# Altium project stm32-plc.PrjPcb (part 1 of 2)
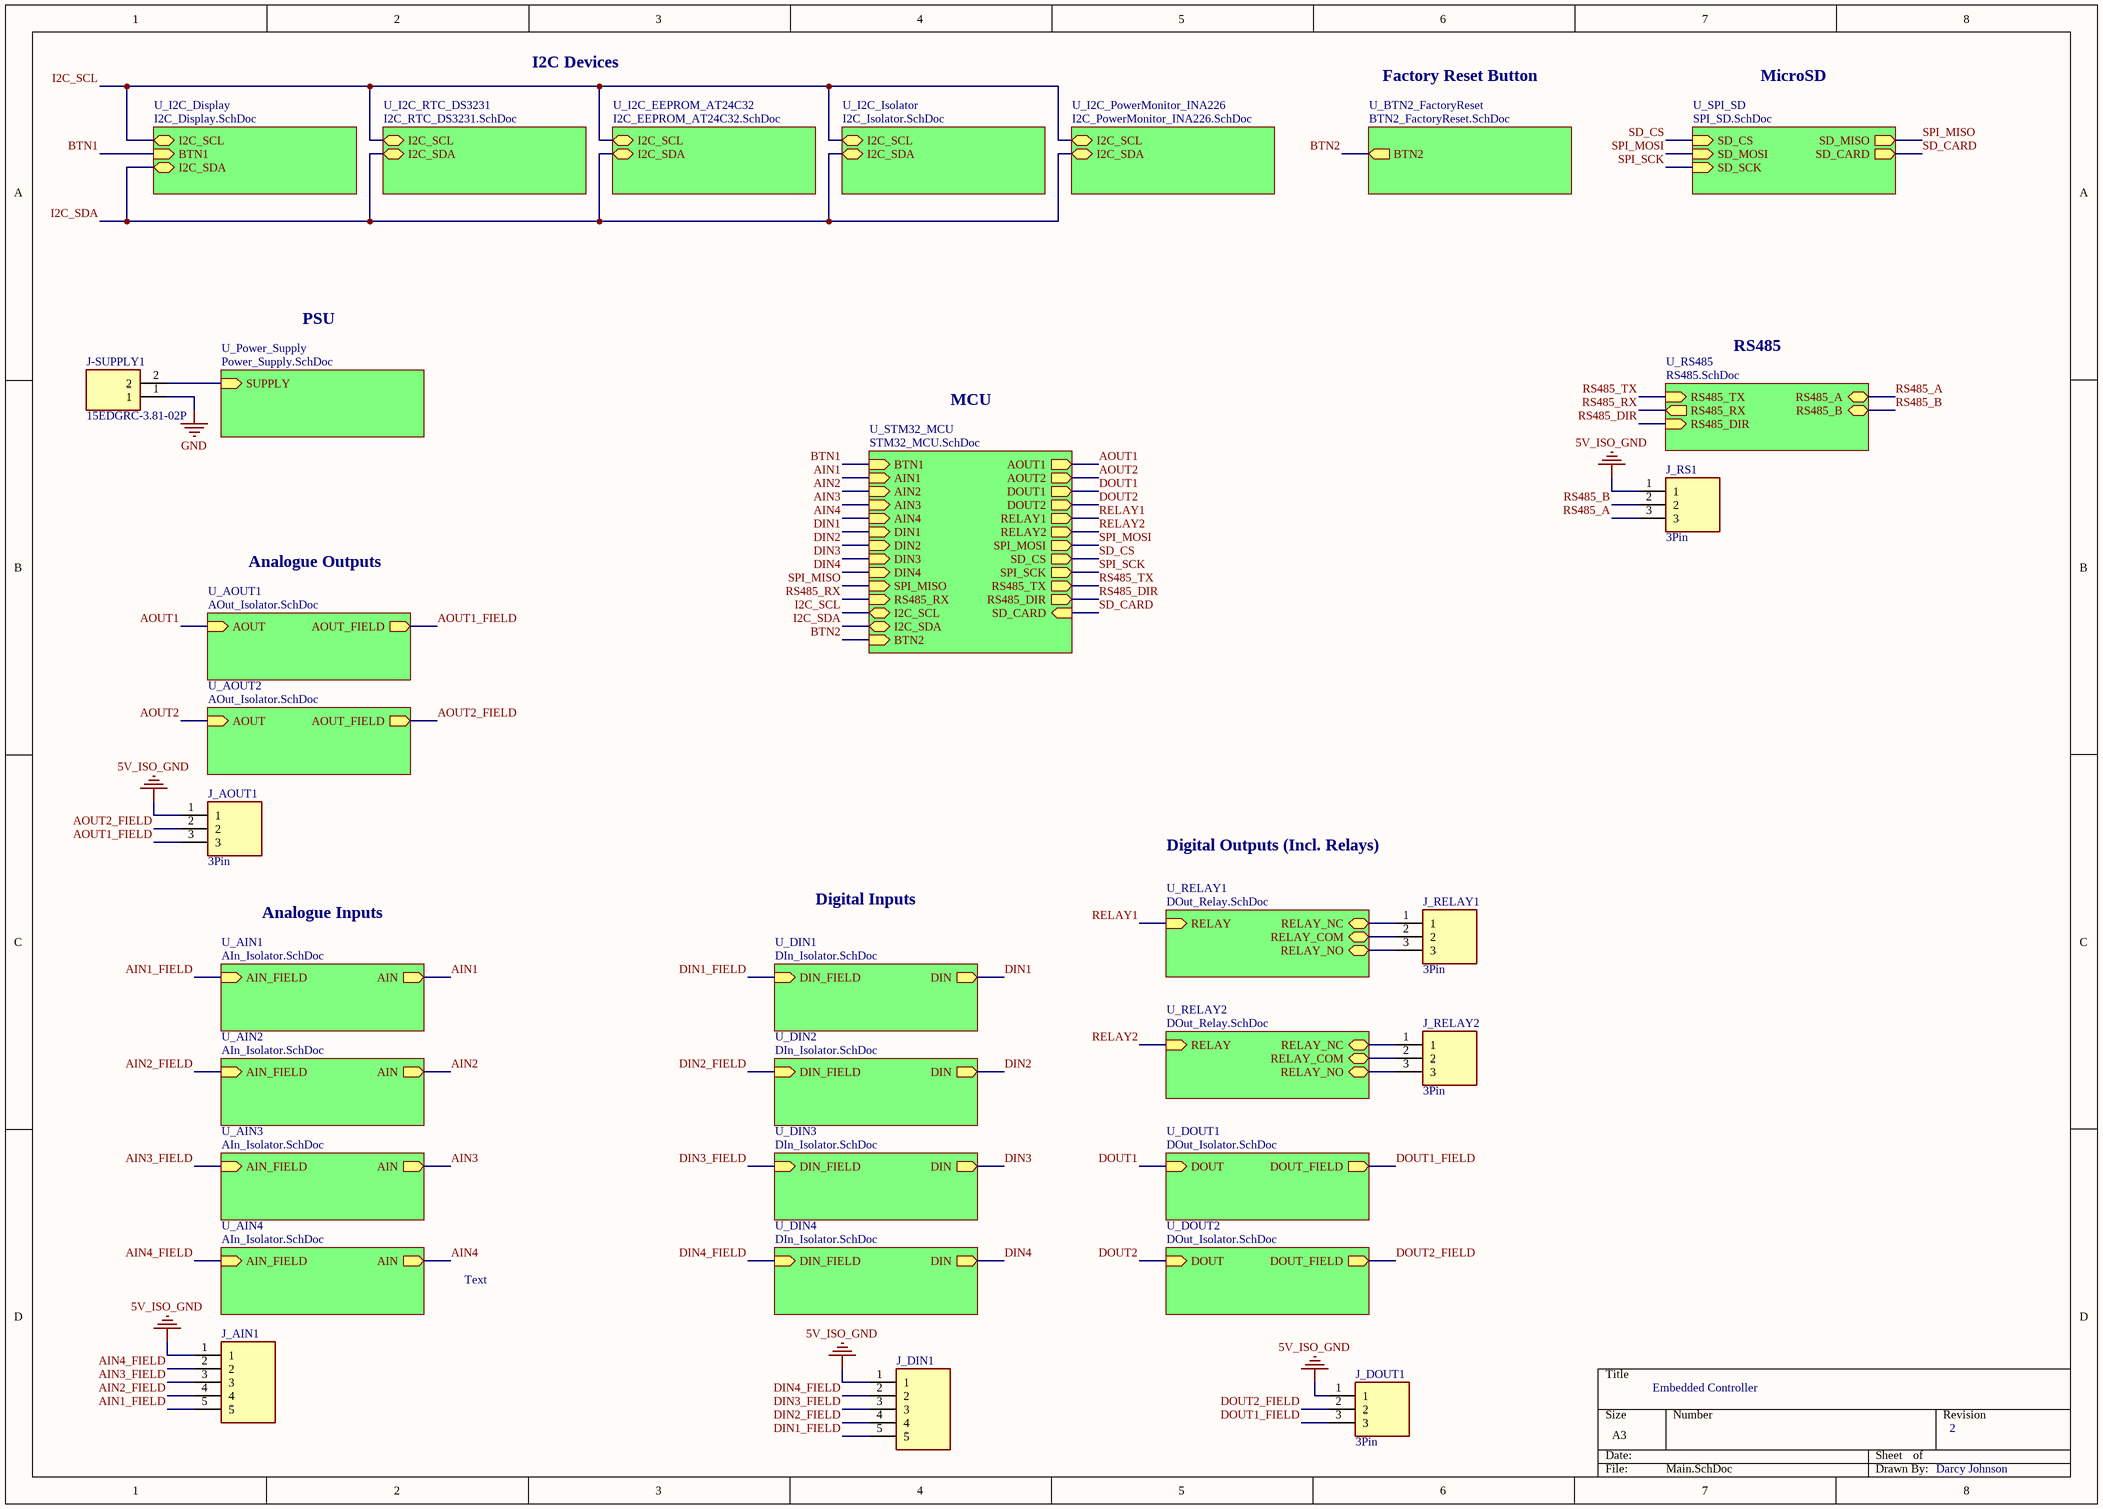
[diagram p0: Main.SchDoc]
Title: Embedded Controller; Revision: 2; DrawnBy: Darcy Johnson
16 sheets, 236 parts. Net scope: hierarchical (ports join the sheet entries above them; power ports are global).
Board file: Main.PcbDoc
Sheets:
  Main.SchDoc
    U_Power_Supply = Power_Supply.SchDoc
    U_I2C_Display = I2C_Display.SchDoc
    U_I2C_EEPROM_AT24C32 = I2C_EEPROM_AT24C32.SchDoc
    U_I2C_RTC_DS3231 = I2C_RTC_DS3231.SchDoc
    U_RS485 = RS485.SchDoc
    U_I2C_Isolator = I2C_Isolator.SchDoc
    U_AIN1 = AIn_Isolator.SchDoc
    U_AIN2 = AIn_Isolator.SchDoc
    U_AIN3 = AIn_Isolator.SchDoc
    U_AIN4 = AIn_Isolator.SchDoc
    U_AOUT1 = AOut_Isolator.SchDoc
    U_AOUT2 = AOut_Isolator.SchDoc
    U_BTN2_FactoryReset = BTN2_FactoryReset.SchDoc
    U_STM32_MCU = STM32_MCU.SchDoc
    U_I2C_PowerMonitor_INA226 = I2C_PowerMonitor_INA226.SchDoc
    U_RELAY1 = DOut_Relay.SchDoc
    U_RELAY2 = DOut_Relay.SchDoc
    U_DIN1 = DIn_Isolator.SchDoc
    U_DIN2 = DIn_Isolator.SchDoc
    U_DIN3 = DIn_Isolator.SchDoc
    U_DIN4 = DIn_Isolator.SchDoc
    U_SPI_SD = SPI_SD.SchDoc
    U_DOUT1 = DOut_Isolator.SchDoc
    U_DOUT2 = DOut_Isolator.SchDoc

## Sheet Main.SchDoc: Embedded Controller
size A3; DocumentNumber: 1; SheetNumber: 1; SheetTotal: 16

### Parts
J-SUPPLY1  15EDGRC-3.81-02P  [15EDGRC-3.81-02P]
J_AIN1  (no value)  [15EDGRC-3.81-05P]
J_AOUT1  3Pin  [15EDGRC-3.81-03P]
J_DIN1  (no value)  [15EDGRC-3.81-05P]
J_DOUT1  3Pin  [15EDGRC-3.81-03P]
J_RELAY1  3Pin  [15EDGRC-3.81-03P]
J_RELAY2  3Pin  [15EDGRC-3.81-03P]
J_RS1  3Pin  [15EDGRC-3.81-03P]

### Sub-sheets
U_AIN1 = AIn_Isolator.SchDoc: AIN (out), AIN_FIELD (in)
U_AIN2 = AIn_Isolator.SchDoc: AIN (out), AIN_FIELD (in)
U_AIN3 = AIn_Isolator.SchDoc: AIN (out), AIN_FIELD (in)
U_AIN4 = AIn_Isolator.SchDoc: AIN (out), AIN_FIELD (in)
U_AOUT1 = AOut_Isolator.SchDoc: AOUT_FIELD (out), AOUT (in)
U_AOUT2 = AOut_Isolator.SchDoc: AOUT_FIELD (out), AOUT (in)
U_BTN2_FactoryReset = BTN2_FactoryReset.SchDoc: BTN2 (out)
U_DIN1 = DIn_Isolator.SchDoc: DIN_FIELD (in), DIN (out)
U_DIN2 = DIn_Isolator.SchDoc: DIN_FIELD (in), DIN (out)
U_DIN3 = DIn_Isolator.SchDoc: DIN_FIELD (in), DIN (out)
U_DIN4 = DIn_Isolator.SchDoc: DIN_FIELD (in), DIN (out)
U_DOUT1 = DOut_Isolator.SchDoc: DOUT (in), DOUT_FIELD (out)
U_DOUT2 = DOut_Isolator.SchDoc: DOUT (in), DOUT_FIELD (out)
U_I2C_Display = I2C_Display.SchDoc: I2C_SCL (bidir), I2C_SDA (bidir), BTN1 (in)
U_I2C_EEPROM_AT24C32 = I2C_EEPROM_AT24C32.SchDoc: I2C_SCL (bidir), I2C_SDA (bidir)
U_I2C_Isolator = I2C_Isolator.SchDoc: I2C_SCL (bidir), I2C_SDA (bidir)
U_I2C_PowerMonitor_INA226 = I2C_PowerMonitor_INA226.SchDoc: I2C_SCL (bidir), I2C_SDA (bidir)
U_I2C_RTC_DS3231 = I2C_RTC_DS3231.SchDoc: I2C_SDA (bidir), I2C_SCL (bidir)
U_Power_Supply = Power_Supply.SchDoc: SUPPLY (in)
U_RELAY1 = DOut_Relay.SchDoc: RELAY (in), RELAY_NO (bidir), RELAY_NC (bidir), RELAY_COM (bidir)
U_RELAY2 = DOut_Relay.SchDoc: RELAY (in), RELAY_NO (bidir), RELAY_NC (bidir), RELAY_COM (bidir)
U_RS485 = RS485.SchDoc: RS485_RX (out), RS485_TX (in), RS485_DIR (in), RS485_A (bidir), RS485_B (bidir)
U_SPI_SD = SPI_SD.SchDoc: SD_CS (in), SD_MOSI (in), SD_SCK (in), SD_MISO (out), SD_CARD (out)
U_STM32_MCU = STM32_MCU.SchDoc: BTN1 (in), AIN1 (in), AIN2 (in), AIN3 (in), AIN4 (in), DIN1 (in), DIN2 (in), DIN3 (in), DIN4 (in), AOUT1 (out), AOUT2 (out), DOUT1 (out), DOUT2 (out), RELAY1 (out), RELAY2 (out), SPI_MISO (in), SPI_MOSI (out), SD_CS (out), SPI_SCK (out), RS485_TX (out), RS485_RX (in), RS485_DIR (out), I2C_SCL (bidir), I2C_SDA (bidir), BTN2 (in), SD_CARD (in)

### Nets
5V_ISO_GND: J_AIN1.1 J_AOUT1.1 J_DIN1.1 J_DOUT1.1 J_RS1.1
GND: J-SUPPLY1.1
AIN1: sheet U_AIN1/AIN, sheet U_STM32_MCU/AIN1
AIN1_FIELD: J_AIN1.5 ; sheet U_AIN1/AIN_FIELD
AIN2: sheet U_AIN2/AIN, sheet U_STM32_MCU/AIN2
AIN2_FIELD: J_AIN1.4 ; sheet U_AIN2/AIN_FIELD
AIN3: sheet U_AIN3/AIN, sheet U_STM32_MCU/AIN3
AIN3_FIELD: J_AIN1.3 ; sheet U_AIN3/AIN_FIELD
AIN4: sheet U_AIN4/AIN, sheet U_STM32_MCU/AIN4
AIN4_FIELD: J_AIN1.2 ; sheet U_AIN4/AIN_FIELD
AOUT1: sheet U_AOUT1/AOUT, sheet U_STM32_MCU/AOUT1
AOUT1_FIELD: J_AOUT1.3 ; sheet U_AOUT1/AOUT_FIELD
AOUT2: sheet U_AOUT2/AOUT, sheet U_STM32_MCU/AOUT2
AOUT2_FIELD: J_AOUT1.2 ; sheet U_AOUT2/AOUT_FIELD
BTN1: sheet U_I2C_Display/BTN1, sheet U_STM32_MCU/BTN1
BTN2: sheet U_BTN2_FactoryReset/BTN2, sheet U_STM32_MCU/BTN2
DIN1: sheet U_STM32_MCU/DIN1, sheet U_DIN1/DIN
DIN1_FIELD: J_DIN1.5 ; sheet U_DIN1/DIN_FIELD
DIN2: sheet U_STM32_MCU/DIN2, sheet U_DIN2/DIN
DIN2_FIELD: J_DIN1.4 ; sheet U_DIN2/DIN_FIELD
DIN3: sheet U_STM32_MCU/DIN3, sheet U_DIN3/DIN
DIN3_FIELD: J_DIN1.3 ; sheet U_DIN3/DIN_FIELD
DIN4: sheet U_STM32_MCU/DIN4, sheet U_DIN4/DIN
DIN4_FIELD: J_DIN1.2 ; sheet U_DIN4/DIN_FIELD
DOUT1: sheet U_STM32_MCU/DOUT1, sheet U_DOUT1/DOUT
DOUT1_FIELD: J_DOUT1.3 ; sheet U_DOUT1/DOUT_FIELD
DOUT2: sheet U_STM32_MCU/DOUT2, sheet U_DOUT2/DOUT
DOUT2_FIELD: J_DOUT1.2 ; sheet U_DOUT2/DOUT_FIELD
I2C_SCL: sheet U_I2C_Display/I2C_SCL, sheet U_I2C_EEPROM_AT24C32/I2C_SCL, sheet U_I2C_RTC_DS3231/I2C_SCL, sheet U_I2C_Isolator/I2C_SCL, sheet U_STM32_MCU/I2C_SCL, sheet U_I2C_PowerMonitor_INA226/I2C_SCL
I2C_SDA: sheet U_I2C_Display/I2C_SDA, sheet U_I2C_EEPROM_AT24C32/I2C_SDA, sheet U_I2C_RTC_DS3231/I2C_SDA, sheet U_I2C_Isolator/I2C_SDA, sheet U_STM32_MCU/I2C_SDA, sheet U_I2C_PowerMonitor_INA226/I2C_SDA
RELAY1: sheet U_STM32_MCU/RELAY1, sheet U_RELAY1/RELAY  [project net PB1]
RELAY2: sheet U_STM32_MCU/RELAY2, sheet U_RELAY2/RELAY  [project net PB2]
RS485_A: J_RS1.3 ; sheet U_RS485/RS485_A  [project net A]
RS485_B: J_RS1.2 ; sheet U_RS485/RS485_B  [project net B]
RS485_DIR: sheet U_RS485/RS485_DIR, sheet U_STM32_MCU/RS485_DIR  [project net PA8]
RS485_RX: sheet U_RS485/RS485_RX, sheet U_STM32_MCU/RS485_RX  [project net PA10]
RS485_TX: sheet U_RS485/RS485_TX, sheet U_STM32_MCU/RS485_TX  [project net PA9]
SD_CARD: sheet U_STM32_MCU/SD_CARD, sheet U_SPI_SD/SD_CARD  [project net CARD_DETECT]
SD_CS: sheet U_STM32_MCU/SD_CS, sheet U_SPI_SD/SD_CS  [project net DAT3]
SPI_MISO: sheet U_STM32_MCU/SPI_MISO, sheet U_SPI_SD/SD_MISO  [project net DAT0]
SPI_MOSI: sheet U_STM32_MCU/SPI_MOSI, sheet U_SPI_SD/SD_MOSI  [project net CMD]
SPI_SCK: sheet U_STM32_MCU/SPI_SCK, sheet U_SPI_SD/SD_SCK  [project net PB3]
NetF1_1: J-SUPPLY1.2 ; sheet U_Power_Supply/SUPPLY
NetJ_RELAY1_1: J_RELAY1.1 ; sheet U_RELAY1/RELAY_NC
NetJ_RELAY1_2: J_RELAY1.2 ; sheet U_RELAY1/RELAY_COM
NetJ_RELAY1_3: J_RELAY1.3 ; sheet U_RELAY1/RELAY_NO
NetJ_RELAY2_1: J_RELAY2.1 ; sheet U_RELAY2/RELAY_NC
NetJ_RELAY2_2: J_RELAY2.2 ; sheet U_RELAY2/RELAY_COM
NetJ_RELAY2_3: J_RELAY2.3 ; sheet U_RELAY2/RELAY_NO

### Notes on the sheet
- I2C Devices
- Factory Reset Button
- MicroSD
- PSU
- RS485
- MCU
- Analogue Outputs
- Digital Outputs (Incl. Relays)
- Analogue Inputs
- Digital Inputs
- Text

### Library data of the parts
J-SUPPLY1 = 15EDGRC-3.81-02P: Manufacturer_Name: Degson; Manufacturer_Part_Number: 15EDGRC-3.81-02P-14-00A(H); Geometry.Height: 7.2mm; Mouser Part Number: *; Mouser Price/Stock: *; Arrow Part Number: *; Arrow Price/Stock: *; Datasheet Link: https://www.tme.com/uz/ru/details/15edgrc3.81-02p/klemmnye-kolodki-razemnogo-tipa/degson-electronics/15edgrc-3-81-02p-14-00a-h/
J_AIN1 J_DIN1 = 15EDGRC-3.81-05P: Manufacturer_Name: Degson; Manufacturer_Part_Number: 15EDGRC-3.81-02P-14-00A(H); Geometry.Height: 7.2mm; Mouser Part Number: *; Mouser Price/Stock: *; Arrow Part Number: *; Arrow Price/Stock: *; Datasheet Link: https://www.tme.com/uz/ru/details/15edgrc3.81-02p/klemmnye-kolodki-razemnogo-tipa/degson-electronics/15edgrc-3-81-02p-14-00a-h/
J_AOUT1 J_DOUT1 J_RELAY1 J_RELAY2 J_RS1 = 15EDGRC-3.81-03P: Manufacturer_Name: Degson; Manufacturer_Part_Number: 15EDGRC-3.81-02P-14-00A(H); Geometry.Height: 7.2mm; Mouser Part Number: *; Mouser Price/Stock: *; Arrow Part Number: *; Arrow Price/Stock: *; Datasheet Link: https://www.tme.com/uz/ru/details/15edgrc3.81-02p/klemmnye-kolodki-razemnogo-tipa/degson-electronics/15edgrc-3-81-02p-14-00a-h/

## Sheet Power_Supply.SchDoc: Embedded Controller
size A4; DocumentNumber: 8; SheetNumber: 8; SheetTotal: 16
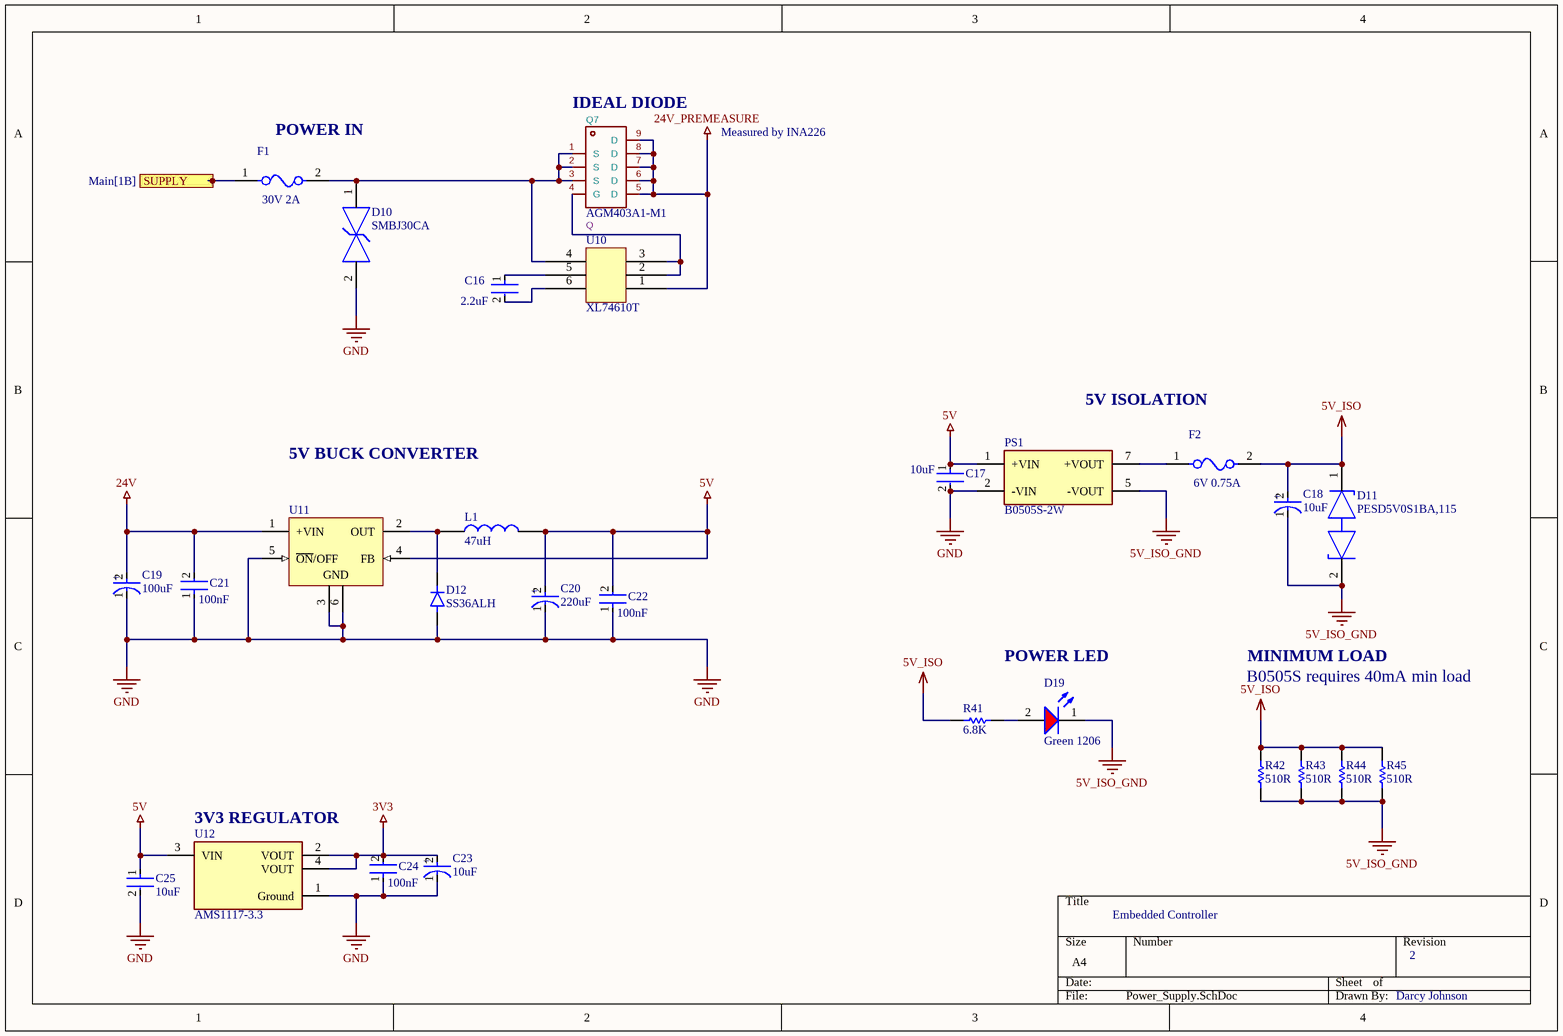
[diagram p1: Power_Supply.SchDoc]

### Parts
C16  2.2uF  [FP-GRM188-0_1-e0_2_0_5-MFG]
C17  10uF  [FP-C3216-160-0_2-IPC_A]
C18  10uF  [FP-FKB-MFG]
C19  100uF  [FP-FKF-MFG]
C20  220uF  [FP-FPF-MFG]
C21  100nF  [FP-1206-L_3_2_0_2-W_1_6_0-MFG]
C22  100nF  [FP-1206-L_3_2_0_2-W_1_6_0-MFG]
C23  10uF  [FP-FKB-MFG]
C24  100nF  [FP-1206-L_3_2_0_2-W_1_6_0-MFG]
C25  10uF  [FP-C3216-160-0_2-IPC_A]
D10  SMBJ30CA  [FP-SMBJ30CAHE3-52-MFG]
D11  PESD5V0S1BA,115  [FP-SOD323-CA-MFG]
D12  SS36ALH  [SODFL5226X100N]
D19  Green 1206  [WL-SMCW_1206_150120xx75000]
F1  30V 2A  [FP-MF-USMF-MFG]
F2  6V 0.75A  [FP-MF-USMF-MFG]
L1  47uH  [INDPM120120X800N]
PS1  B0505S-2W  [B0505S-2W]
Q7  AGM403A1-M1  Reference: Q  [DFN8_5X6MM]
R41  6.8K  [RESC1608X55X30LL15T15]
R42  510R  [RESC3216X70X50LL20T25]
R43  510R  [RESC3216X70X50LL20T25]
R44  510R  [RESC3216X70X50LL20T25]
R45  510R  [RESC3216X70X50LL20T25]
U10  XL74610T  [SOT95P245X110-6N]
U11  (no value)  [KTT0005B_L]
U12  AMS1117-3.3  [FP-AMS1117-IPC_C]

### Ports
SUPPLY (in, see Main[1B])

### Nets
3V3: C23.2(A) C24.2 U12.2(VOUT) U12.4(VOUT)
5V: C17.1 C20.2(A) C22.2 C25.1 L1.2 PS1.1(+VIN) U11.4(FB) U12.3(VIN)
5V_ISO: C18.2(A) D11.1(K1) F2.2 R41.1 R42.1 R43.1 R44.1 R45.1
5V_ISO_GND: C18.1(C) D11.2(K2) D19.1(K) PS1.5(-VOUT) R42.2 R43.2 R44.2 R45.2
24V: C19.2(A) C21.2 U11.1(+VIN)
24V_PREMEASURE: Q7.5(D) Q7.6(D) Q7.7(D) Q7.8(D) Q7.9(D) U10.1
GND: C17.2 C19.1(C) C20.1(C) C21.1 C22.1 C23.1(C) C24.1 C25.2 D10.2 D12.2(A) PS1.2(-VIN) U11.3(GND) U11.5(~{ON}/OFF) U11.6(GND) U12.1(Ground)
NetC16_1: C16.1 U10.5
NetC16_2: C16.2 U10.6
NetD10_1: D10.1 F1.2 Q7.1(S) Q7.2(S) Q7.3(S) U10.4
NetD12_1: D12.1(K) L1.1 U11.2(OUT)
NetD19_2: D19.2(A) R41.2
NetF1_1: F1.1 ; port SUPPLY
NetF2_1: F2.1 PS1.7(+VOUT)
NetQ7_4: Q7.4(G) U10.2 U10.3

### Notes on the sheet
- (near Q7) IDEAL DIODE
- (near F1) POWER IN
- Measured by INA226
- 5V ISOLATION
- 5V BUCK CONVERTER
- POWER LED
- B0505S requires 40mA min load
- MINIMUM LOAD
- (near U12) 3V3 REGULATOR
- (in symbol CMP-2000-06208-3) +
- (in symbol CMP-2000-06211-2) +
- (in symbol CMP-2000-06215-2) +

### Library data of the parts
C16 = CMP-2006-02836-2: Chip Multilayer Ceramic Capacitors for General Purpose, 0603, 2.2uF, X7R, 15%, 10%, 10V; Case Code (Metric): 1608; Height: 0.8mm; Packaging: Cut Tape; Voltage: 10V; Lead Free: Lead Free; Min Operating Temperature: -55°C; Voltage Rating (DC): 10V; Max Operating Temperature: 125°C; Voltage Rating: 10V; Dielectric: X7R; Depth: 0.8mm; Case Code (Imperial): 0603; Termination: SMD/SMT; Case/Package: 0603; Number of Pins: 2; REACH SVHC: No SVHC; Mount: Surface Mount; Width: 0.031inch; Material: Ceramic; Capacitance: 2.2uF; Package Quantity: 1; Weight: 7.1E-05oz; Length: 1.6mm; Thickness: 0.035inch; Tolerance: 10%
C17 C25 = CMP-2000-06045-2: Multilayer Ceramic Capacitors 10uF ±10% 50V X5R SMD 1206; Min Operating Temperature: -55°C; Weight: 0.000571oz; Tolerance: 10%; Lead Free: Lead Free; REACH SVHC: No SVHC; Dielectric Material: Ceramic; Termination: SMD/SMT; Radiation Hardening: No; Case Code (Metric): 3216; Max Operating Temperature: 85°C; Voltage Rating (DC): 50V; Packaging: Tape and Reel; Height: 1.6mm; Voltage: 50V; Dielectric: X5R; Mount: Surface Mount; Voltage Rating: 50V; Capacitance: 10uF; Length: 3.2mm; RoHS Compliant: Yes; Thickness: 0.071inch; Depth: 1.6mm; Width: 0.063inch; Case/Package: 1206; Series: C; Package Quantity: 1; Resistor Type: Ceramic; Case Code (Imperial): 1206; Construction: Flat
C18 C23 = CMP-2000-06211-2: CAP ALUM 10UF 20% 35V SMD; ESR (Equivalent Series Resistance): 1.35R; Ripple Current: 90mA; Leakage Current: 3uA; Polarity: Polar; Material: Aluminium; Life (Hours): 2000Hour; Height: 5.8mm; Voltage Rating: 35V; Max Operating Temperature: 105°C; Ripple Current (AC): 90mA; Voltage: 35V; Height - Seated (Max): 0.24inch; Lead Free: Lead Free; Contact Plating: Tin; Capacitance: 10uF; Series: FK; REACH SVHC: No SVHC; Construction: Cylindrical; Tolerance: 20%; Voltage Rating (DC): 35V; Number of Pins: 2; Packaging: Tape and Reel; RoHS Compliant: Yes; Min Operating Temperature: -55°C; Impedance: 1.35R; Package Quantity: 1; Termination: SMD/SMT; Length: 5.8mm; Case/Package: Radial; Diameter: 4mm; Radiation Hardening: No; Width: 5.5mm; Mount: Surface Mount
C19 = CMP-2000-06208-3: CAP ALUM 100UF 20% 50V SMD; Leakage Current: 3uA; ESR (Equivalent Series Resistance): 340mR; Material: Aluminium; Ripple Current: 350mA; Life (Hours): 2000Hour; Min Operating Temperature: -55°C; Contact Plating: Tin; REACH SVHC: No SVHC; RoHS Compliant: Yes; Width: 10mm; Radiation Hardening: No; Termination: SMD/SMT; Packaging: Tape and Reel; Max Operating Temperature: 105°C; Case/Package: Radial; Voltage Rating: 50V; Length: 10.2mm; Voltage: 50V; Package Quantity: 1; Voltage Rating (DC): 50V; Height - Seated (Max): 0.402inch; Mount: Surface Mount; Impedance: 340mR; Construction: Cylindrical; Height: 10.2mm; Lead Free: Lead Free; Dielectric Material: Aluminium; Series: FK; Tolerance: 20%; Diameter: 8mm; Ripple Current (AC): 350mA; Capacitance: 100uF; Number of Pins: 2
C20 = CMP-2000-06215-2: CAP ALUM 220UF 20% 35V SMD; Ripple Current (AC): 850mA; Life (Hours): 2000Hour; Polarity: Polar; ESR (Equivalent Series Resistance): 80mR; Material: Aluminium; Leakage Current: 77uA; RoHS Compliant: Yes; Number of Pins: 2; Length: 10.5mm; Height - Seated (Max): 0.402inch; Lead Pitch: 3.1mm; Construction: Cylindrical; Contact Plating: Tin; Tolerance: 20%; Voltage: 35V; REACH SVHC: No SVHC; Capacitance: 220uF; Width: 8.3mm; Max Operating Temperature: 105°C; Mount: Surface Mount; Package Quantity: 500; Min Operating Temperature: -55°C; Diameter: 8mm; Voltage Rating (DC): 35V; Packaging: Tape and Reel; Termination: SMD/SMT; Ripple Current: 850mA; Series: FP; Radiation Hardening: No; Case/Package: Radial; Voltage Rating: 35V; Height: 10.2mm; Lead Free: Lead Free
C21 C22 C24 = CMP-2000-05018-2: General Purpose Ceramic Capacitor, 1206, 100nF, 10%, X7R, 15%, 50V; Dissipation Factor: 2.5%; Insulation Resistance: 100GR; Dielectric: X7R; Thickness: 0.037inch; Case Code (Imperial): 1206; Case Code (Metric): 3216; Dielectric Material: Ceramic; Width: 1.6mm; Voltage Rating (DC): 50V; Termination: SMD/SMT; Tolerance: 10%; REACH SVHC: No SVHC; Height: 0.94mm; Length: 3.2mm; Voltage: 50V; Capacitance: 100nF; Packaging: Tape and Reel; Depth: 1.6mm; Voltage Rating: 50V; Series: -; Contact Plating: Tin; Mount: Surface Mount; Package Quantity: 1; Construction: Flat; Max Operating Temperature: 125°C; Min Operating Temperature: -55°C; Case/Package: 1206; Lead Free: Lead Free; RoHS Compliant: Yes; Number of Pins: 2; Radiation Hardening: No
D10 = CMP-02577-000018-1: TVS DIODE 30V 48.4V DO214AA; Manufacturer: Vishay Semiconductor Diodes Division; Manufacturer Part Number: SMBJ30CAHE3/52; Peak Pulse Power: 600W; Number Of Channels: 1; Automotive Grade: Grade 0; Peak Pulse Current: 12.4A; Standoff Height: 0mm; Max Junction Temp: +150°C; Breakdown Voltage: 33.3V; Direction: Bidirectional; Octopart: https://octopart.com/smbj30cahe3%2F52-vishay-43725255; Footprint Url: http://www.vishay.com/docs/95401/smb.pdf; Device Class L2: TVS Diodes; RoHS: TRUE; Automotive: Yes; Height: 2.44mm; Temperature: -55°C to +150°C; Category: Diode; ComponentLink2Description: Datasheet; Reverse Standoff Voltage: 30V; Device Class L3: unset; Package: DO-214AA; ComponentLink2URL: http://www.vishay.com/docs/88392/smbj.pdf; Temperature Range Low: -55°C; Mouser Description: Diode TVS Single Bi-Dir 30V 600W 2-Pin DO-214AA T/R; Temperature Range High: +150°C; Digikey Description: TVS DIODE 30V 48.4V DO214AA; Clamping Voltage: 48.4V; Lead Free: Yes; Device Class L1: Circuit Protection
D11 = CMP-14432-000001-1: TVS DIODE 5V 14V SOD323
D12 = SS36ALH: 3A, 60V, Schottky Rectifier; MF: Taiwan Semiconductor; MP: SS36ALH; Package: DO-221AC Taiwan Semiconductor; Price: None; Value: *; SnapEDA_Link: https://www.snapeda.com/parts/SS36ALH/Taiwan+Semiconductor/view-part/?ref=snap; Check_prices: https://www.snapeda.com/parts/SS36ALH/Taiwan+Semiconductor/view-part/?ref=eda; Availability: Not in stock
D19 = CMP-1426-00017-3: Led, Red, 630 Nm, 1.9 V, 30 Ma, 60 Mcd Rohs Compliant: Yes; Forward Current: 100mA; Max Reverse Voltage (DC): 5V; Lens Style: Clear, Rectangular; Viewing Angle: 140°; Luminous Intensity: 60mcd; Peak Wavelength: 645nm; Forward Voltage: 1.9V; Test Current: 20mA; Dominant Wavelength: 630nm; Case Code (Imperial): 1206; Length: 3.2mm; Mount: Surface Mount; Case Code (Metric): 3216; Case/Package: 1206; Min Operating Temperature: -40°C; Width: 1.6mm; Color: Red; Height: 680µm; REACH SVHC: Unknown; Max Operating Temperature: 85°C; Wavelength: 630nm; RoHS: Compliant; Packaging: Tape and Reel
F1 F2 = CMP-07400-000009-1: PTC RESET FUSE 30V 200MA 1210; Manufacturer: Bourns Inc.; Manufacturer Part Number: MF-USMF020-2; Current Rating: 10A; Resistance: 0.4-5Ω; Trip Time: 0.02s; Automotive Grade: Grade 3; Value: 0.4-5Ω; Hold Current: 0.2A; Trip Current: 0.4A; ComponentLink2URL: https://www.bourns.com/docs/Product-Datasheets/mfusmf.pdf; Category: Fuse; Temperature Range High: +85°C; Temperature: -40°C to +85°C; Device Class L3: unset; Device Class L2: PTC Resettable Fuses; Automotive: Yes; Height: 1.1mm; Package: MF-USMF; Device Class L1: Circuit Protection; Mouser Description: Resettable Fuses - PPTC 0.20A 30V 0.40ohm Hold .20A Trip .4A; ComponentLink2Description: Datasheet; Temperature Range Low: -40°C; RoHS: TRUE; Lead Free: Yes; Voltage Rating: 30V; Octopart: https://octopart.com/mf-usmf020-2-bourns-46429; Digikey Description: PTC RESET FUSE 30V 200MA 1210
L1 = SPD127R-473M: Fixed Inductors 47uH 20% .1ohm Shielded Choke SMT; Manufacturer_Name: API Delevan; Geometry.Height: 8mm; Mouser Part Number: 807-SPD127R-473M; Mouser Price/Stock: https://www.mouser.co.uk/ProductDetail/API-Delevan/SPD127R-473M?qs=Ri2cEtl8%2FQnrzzldCovvkw%3D%3D; Manufacturer_Part_Number: SPD127R-473M; Datasheet Link: https://componentsearchengine.com/Datasheets/1/SPD127R-473M.pdf
PS1 = 2S7BE_0505S3U: Isolated Module DC DC Converter 1 Output 5V 400mA 4.5V - 5.5V Input; MF: Gaptec; SnapEDA_Link: https://www.snapeda.com/parts/2S7BE_0505S3U/Gaptec/view-part/?ref=snap; Package: None; Value: *; MP: 2S7BE_0505S3U; Check_prices: https://www.snapeda.com/parts/2S7BE_0505S3U/Gaptec/view-part/?ref=eda
Q7 = AGM403A1-M1: Type:1 N-channel Drain to Source Voltage: Current - Continuous Drain(Id): RDS(on):2.2mΩ@10V,20A Pd - Power Dissipation(Pd): Gate Threshold Voltage (Vgs(th)@Id):1.2V Gate Charge(Qg):65nC@10V Input Capacitance(Ciss@Vds):5341pF@15V Reverse Transfer Capacitan; Manufacturer: AGM-Semi(芯控源); Footprint: ProLib_pcs_2025-06-23:DFN-8_L5.8-W4.9-P1.27-LS6.0-BL-1; Supplier: LCSC; Datasheet: https://atta.szlcsc.com/upload/public/pdf/source/20241030/BE071EF894F55F0B37AD6167FC56B3C6.pdf; Description_: Type:1 N-channel Drain to Source Voltage: Current - Continuous Drain(Id): RDS(on):2.2mΩ@10V,20A Pd - Power Dissipation(Pd): Gate Threshold Voltage (Vgs(th)@Id):1.2V Gate Charge(Qg):65nC@10V Input Capacitance(Ciss@Vds):5341pF@15V Reverse Transfer Capacitan; Manufacturer Part: AGM403A1-M1; Supplier Part: C42372665; LCSC Part Name: AGM403A1-M1
R41 = CMP-2000-00803-1: Part Number: ERJ-3GEYJ512V; Manufacturer: Panasonic
R42-R45 = CMP-2003-04407-1: Manufacturer: Panasonic; Part Number: ERA8AEB103V
U11 = CMP-2000-06545-1: Simple Switcher(R) Power Converter 150 kHz Step-Down Voltage Regulator, 3 A, 4.5 to 40 V, -40 to 125 degC, 5-Pin TO-263 (KTT), Green (RoHS & no Sb/Br), Tape and Reel; PartNumber: LM2596; Manufacturer: Texas Instruments; Package Version: 4200577-4/G, 01/2013; Primary Input Voltage: 40V; No. of Outputs: 1; No. of Pins: 5; SVHC: NoSVHC(19-Dec-2012); Output Voltage: 37V; Output Current: 3A; Datasheet Version: Rev. C, 04/2013; Package Reference: KTT5; MSL: MSL3-168hours; Number of Outputs: 1; Operating Temperature Min: -40°C; Operating Temperature Range: -40°Cto+125°C; Manufacturer URL: http://www.ti.com/; Package URL: http://www.ti.com/litv/pdf/mpsf007e; Voltage Regulator Case Style: TO-263; Operating Temperature Max: 125°C; Package Description: 5-Pin Plastic Flange Mount, Body 10.16 x 8.925 mm, Pitch 1.7 mm; Datasheet URL: http://www.ti.com/lit/ds/symlink/lm2596.pdf; Mounting Technology: SurfaceMount
U12 = CMP-209535-000001-1: LDO Voltage Regulators 1A, 3.3V; Manufacturer: Advanced Monolithic Systems; Dropout Voltage: 1.1V; Output Type: Fixed; Nominal Supply Current: 5mA; Max Power Dissipation: 1.2W; Max Supply Voltage: 15V; Number Of Outputs: 1; Standoff Height: 0.64mm; Max Junction Temp: +125°C; Height: 1.8mm; Package: AMS1117; Device Class L2: Power Management ICs; ComponentLink2Description: Datasheet; ComponentLink2URL: http://www.advanced-monolithic.com/pdf/ds1117.pdf; Category: IC; RoHS: TRUE; Automotive: No; Device Class L1: Integrated Circuits (ICs); Output Current: 1A; Device Class L3: Voltage Regulators - Linear; Temperature: -40°C to +125°C; Output Voltage: 3.3V; Manufacturer Part Number: AMS1117-3.3; Temperature Range Low: -40°C; Octopart: https://octopart.com/ams1117-3.3-advanced+monolithic+systems-25899300; Lead Free: Yes; Ipc Land Pattern Name: SOT229P700X180-4; Temperature Range High: +125°C

## Sheet I2C_Display.SchDoc: Embedded Controller
size A4; DocumentNumber: 12; SheetNumber: 12; SheetTotal: 16
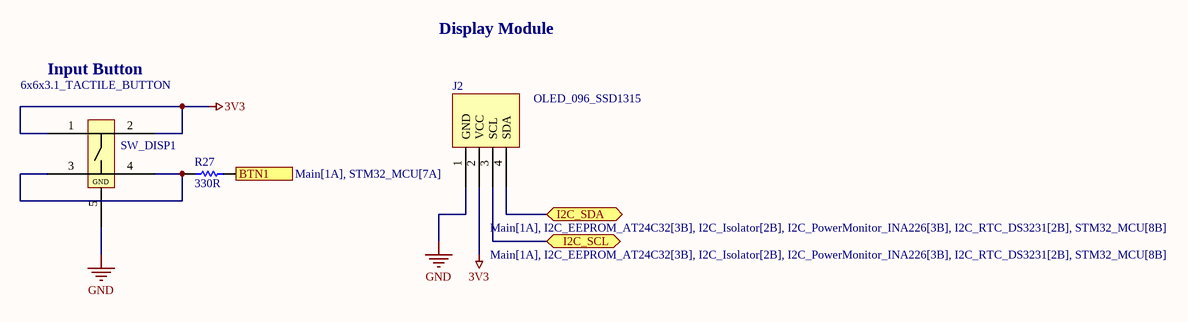
[diagram p2: I2C_Display.SchDoc]

### Parts
J2  OLED_096_SSD1315  [OLED_096_SSD1315]
R27  330R  [RESC1608X55X30LL15T15]
SW_DISP1  6x6x3.1_TACTILE_BUTTON  [6x6x3.1_TACTILE_BUTTON]

### Ports
BTN1 (in, see Main[1A], STM32_MCU[7A]), I2C_SCL (bidir, see Main[1A], I2C_EEPROM_AT24C32[3B], I2C_Isolator[2B], I2C_PowerMonitor_INA226[3B], I2C_RTC_DS3231[2B], STM32_MCU[8B]), I2C_SDA (bidir, see Main[1A], I2C_EEPROM_AT24C32[3B], I2C_Isolator[2B], I2C_PowerMonitor_INA226[3B], I2C_RTC_DS3231[2B], STM32_MCU[8B])

### Nets
3V3: J2.2(VCC) SW_DISP1.1 SW_DISP1.2
GND: J2.1(GND) SW_DISP1.5
BTN1: R27.2 ; port BTN1
I2C_SCL: J2.3(SCL) ; port I2C_SCL
I2C_SDA: J2.4(SDA) ; port I2C_SDA
NetR27_1: R27.1 SW_DISP1.3 SW_DISP1.4

### Notes on the sheet
- Input Button
- Display Module
- (in symbol 6x6x3.1_TACTILE_BUTTON) GND

### Library data of the parts
R27 = CMP-2000-00435-2: Chip Resistor, 330 Ohm, +/- 1%, 0.1 W, -55 to 155 degC, 0603 (1608 Metric), RoHS, Tape and Reel; Gender: Male; Mating Cycles: 10000; Current Rating: 500 mA; Voltage Rating: 10 V; REACH SVHC: No SVHC; PackageDescription: 2-Pin Surface Mount Device, Body 1.6 x 0.85 mm; Contact Finish: Gold; Pins: 8; ComponentLink1Description: Manufacturer URL; Packaging: Tape and Reel; Max Operating Temperature: 85 degC; Contact Material: Copper; Height: 1.45 mm; Width: 1.45 mm; DatasheetVersion: Apr-15; Package Quantity: 1500; Contact Plating: Gold; PackageReference: 0603; Mount: Surface Mount; Lead Pitch: 1.1 mm; Min Operating Temperature: -25 degC; ComponentLink1URL: http://www.panasonic.com/; ComponentLink2URL: http://industrial.panasonic.com/cdbs/www-data/pdf/RDA0000/AOA0000C86.pdf; Length: 13.7 mm; ComponentLink2Description: Datasheet; RoHSCompliant: true

## Sheet I2C_EEPROM_AT24C32.SchDoc: Embedded Controller
size A4; DocumentNumber: 11; SheetNumber: 11; SheetTotal: 16
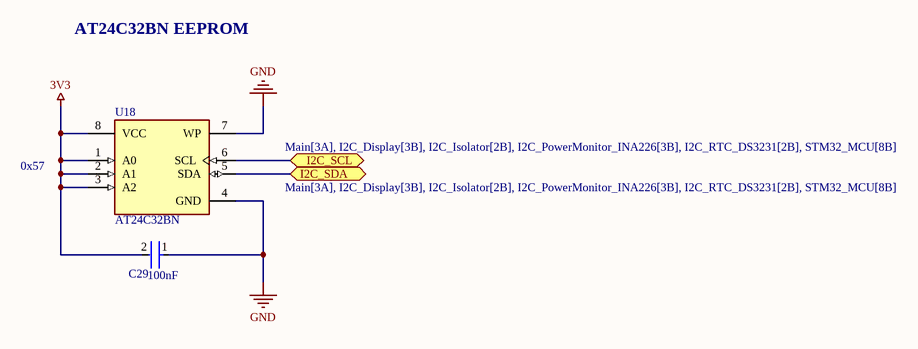
[diagram p3: I2C_EEPROM_AT24C32.SchDoc]

### Parts
C29  100nF  [FP-CGA3E-0_3-0_1-IPC_A]
U18  AT24C32BN  [FP-C04-057-SN-MFG]

### Ports
I2C_SCL (bidir, see Main[3A], I2C_Display[3B], I2C_Isolator[2B], I2C_PowerMonitor_INA226[3B], I2C_RTC_DS3231[2B], STM32_MCU[8B]), I2C_SDA (bidir, see Main[3A], I2C_Display[3B], I2C_Isolator[2B], I2C_PowerMonitor_INA226[3B], I2C_RTC_DS3231[2B], STM32_MCU[8B])

### Nets
3V3: C29.2 U18.1(A0) U18.2(A1) U18.3(A2) U18.8(VCC)
GND: C29.1 U18.4(GND) U18.7(WP)
I2C_SCL: U18.6(SCL) ; port I2C_SCL
I2C_SDA: U18.5(SDA) ; port I2C_SDA

### Notes on the sheet
- AT24C32BN EEPROM
- 0x57

### Library data of the parts
C29 = CMP-2000-07546-2: Cap Ceramic 100nF 50V X7R 10% Pad SMD 0603 +125°C Automotive T/R; Weight: 7.1E-05oz; Composition: Ceramic; Max Operating Temperature: 125°C; Termination: SMD/SMT; Dielectric: X7R; Length: 1.6mm; Package Quantity: 1; REACH SVHC: No SVHC; Lead Free: Lead Free; Case Code (Metric): 1608; Min Operating Temperature: -55°C; Packaging: Tape and Reel; Tolerance: 10%; Voltage Rating: 50V; Case Code (Imperial): 0603; Capacitance: 100nF; Case/Package: 0603; Voltage Rating (DC): 50V; Depth: 0.8mm; Radiation Hardening: No; Ratings: AEC-Q200; Mount: Surface Mount; Voltage: 50V; Thickness: 0.035inch; Width: 0.8mm; Height: 0.8mm
U18 = CMP-06313-000164-1: IC EEPROM 32KBIT I2C 1MHZ 8SOIC; Interface: Serial; Supply Current: 3mA; Organization: 4KX8; Access Time: 550ns; Number of Words: 4096; Max Supply Voltage: 5.5V; Memory Size: 32Kb; Write Protection: YES; Operating Supply Voltage: 5V; Min Supply Voltage: 1.7V; RoHS Compliant: Yes; Radiation Hardening: No; Height: 1.5mm; Frequency: 1MHz; Memory Type: EEPROM; Min Operating Temperature: -40°C; Packaging: Bulk; Case/Package: SOIC; Max Frequency: 1MHz; Package Quantity: 100; Mount: Surface Mount; Density: 32Kb; Series: -; Length: 5.05mm; Number of Pins: 8; Max Operating Temperature: 85°C; Reach SVHC Compliant: Yes; Nominal Supply Current: 3mA; Width: 3.99mm; Access Time-Max: 550ns

## Sheet I2C_RTC_DS3231.SchDoc: Embedded Controller
size A4; DocumentNumber: 5; SheetNumber: 5; SheetTotal: 16
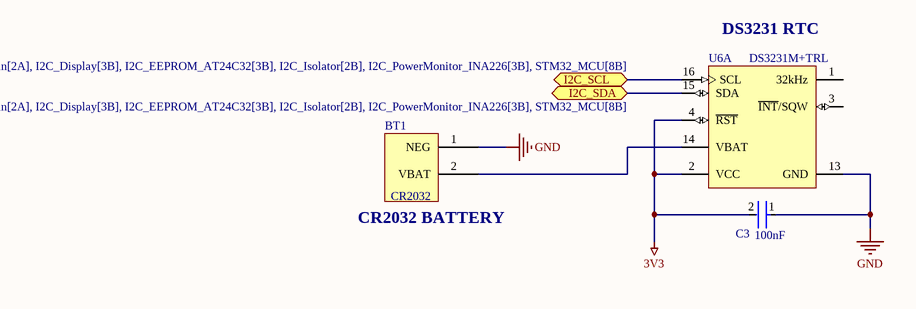
[diagram p4: I2C_RTC_DS3231.SchDoc]

### Parts
BT1  CR2032_HOLDER_TH  [CR2032_HOLDER_TH]  (value not drawn)
C3  100nF  [FP-CGA3E-0_3-0_1-IPC_A]
U6  DS3231M+TRL  [W16MK+1_N]  (part A of 2)

### Ports
I2C_SCL (bidir, see Main[2A], I2C_Display[3B], I2C_EEPROM_AT24C32[3B], I2C_Isolator[2B], I2C_PowerMonitor_INA226[3B], STM32_MCU[8B]), I2C_SDA (bidir, see Main[2A], I2C_Display[3B], I2C_EEPROM_AT24C32[3B], I2C_Isolator[2B], I2C_PowerMonitor_INA226[3B], STM32_MCU[8B])

### Nets
3V3: C3.2 U6.2(VCC) U6.4(~{RST})
GND: BT1.1(NEG) C3.1 U6.13(GND)
I2C_SCL: U6.16(SCL) ; port I2C_SCL
I2C_SDA: U6.15(SDA) ; port I2C_SDA
NetBT1_2: BT1.2(VBAT) U6.14(VBAT)

Not connected (* = marked no-connect by the designer): U6 1(32kHz) 3(~{INT}/SQW)

### Notes on the sheet
- (near U6) DS3231 RTC
- (near BT1) CR2032 BATTERY
- (in symbol CR2032_HOLDER_TH) CR2032

### Library data of the parts
C3 = CMP-2000-07546-2: as C29 on sheet I2C_EEPROM_AT24C32; Weight: 7.1E-05oz; Composition: Ceramic; Max Operating Temperature: 125°C; Termination: SMD/SMT; Dielectric: X7R; Length: 1.6mm; Package Quantity: 1; REACH SVHC: No SVHC; Lead Free: Lead Free; Case Code (Metric): 1608; Min Operating Temperature: -55°C; Packaging: Tape and Reel; Tolerance: 10%; Voltage Rating: 50V; Case Code (Imperial): 0603; Capacitance: 100nF; Case/Package: 0603; Voltage Rating (DC): 50V; Depth: 0.8mm; Radiation Hardening: No; Ratings: AEC-Q200; Mount: Surface Mount; Voltage: 50V; Thickness: 0.035inch; Width: 0.8mm; Height: 0.8mm
U6 = CMP-0254-00002-2: +/-5ppm, MEMS based Real-Time Clock, I2C Interface, 16-Pin SO, -40 to 85 degC, Pb-Free, Reel; ComponentLink2URL: http://datasheets.maxim-ic.com/en/ds/DS3231M.pdf; PackageVersion: revD, 2010; ComponentLink3Description: Package Specification; Code_JEDEC: MS-013-AA; PackageDescription: 16-Pin Small-Outline IC, Wide (0.3in), 1.27 mm Pitch, SOIC (W), Pb-Free; ComponentLink1Description: Manufacturer URL; DatasheetVersion: Rev 3, Dec-2011; Code_IPC: SOIC127P1030-16; ComponentLink3URL: http://pdfserv.maxim-ic.com/package_dwgs/21-0042.PDF; PackageReference: W16MK+1; ComponentLink1URL: http://www.maxim-ic.com; ComponentLink2Description: Datasheet

## Sheet RS485.SchDoc: Embedded Controller
size A4; DocumentNumber: 9; SheetNumber: 9; SheetTotal: 16
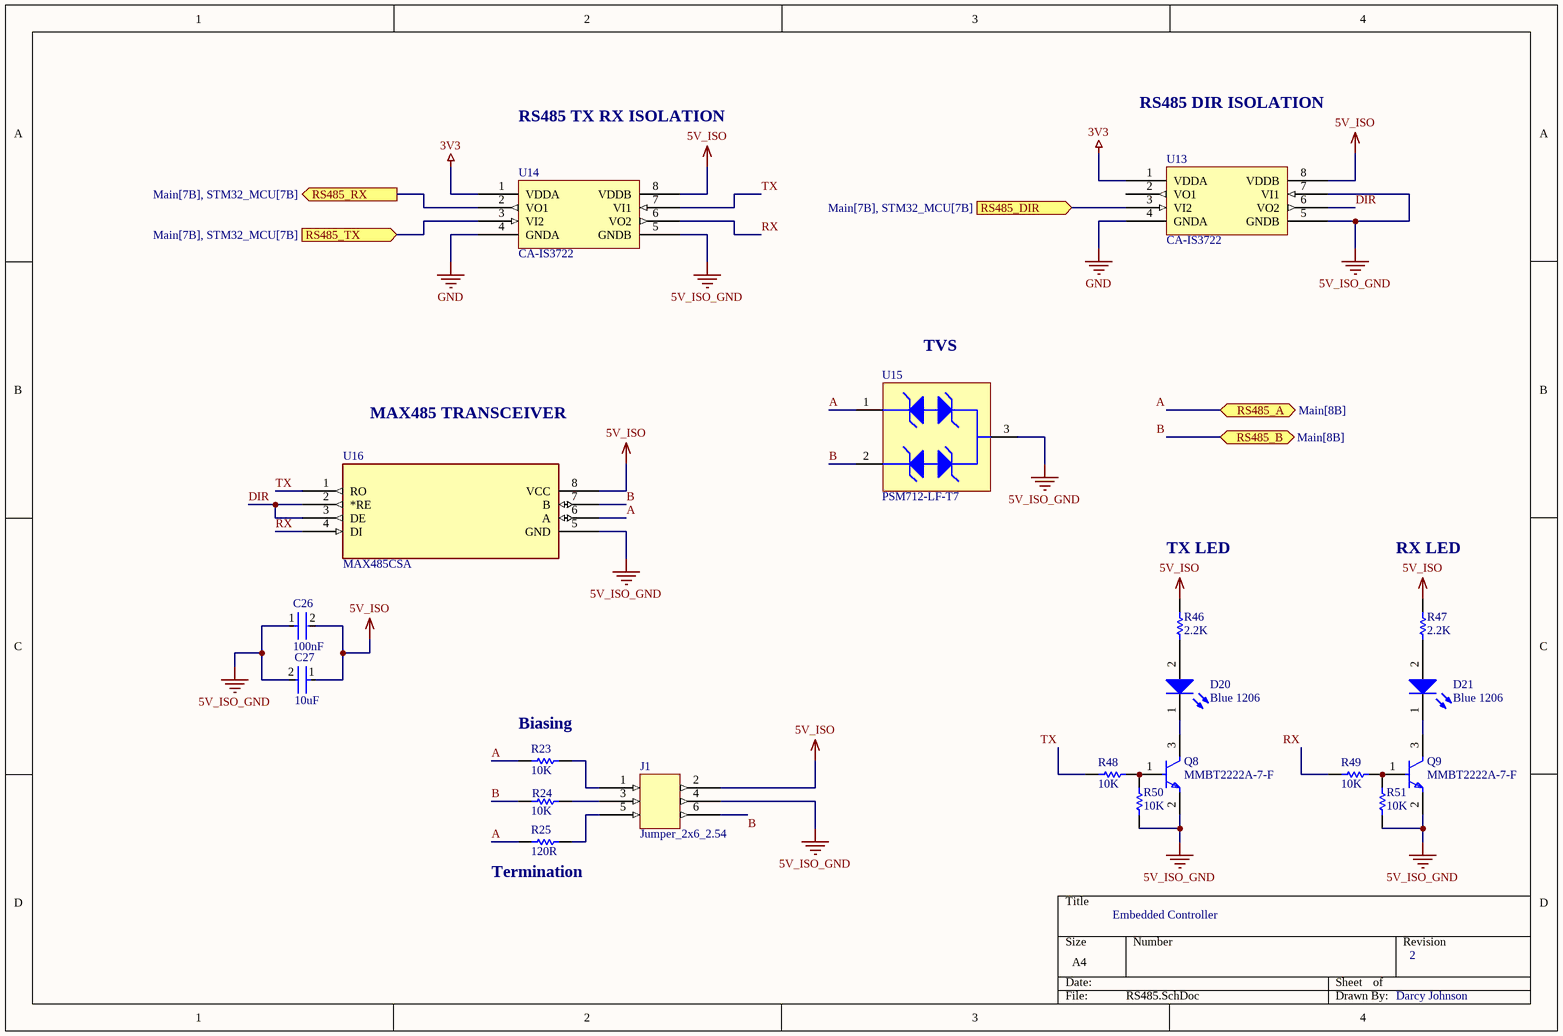
[diagram p5: RS485.SchDoc]

### Parts
C26  100nF  [FP-CGA3E-0_3-0_1-IPC_A]
C27  10uF  [FP-GRM188-0_1-e0_2_0_55-IPC_A]
D20  Blue 1206  [WL-SMCW_1206_150120xx75000]
D21  Blue 1206  [WL-SMCW_1206_150120xx75000]
J1  Jumper_2x6_2.54  [Jumper_2x6_2.54]
Q8  MMBT2222A-7-F  [FP-SOT23-IPC_A]
Q9  MMBT2222A-7-F  [FP-SOT23-IPC_A]
R23  10K  [RESC1609X55X30LL15T15]
R24  10K  [RESC1609X55X30LL15T15]
R25  120R  [RESC1609X55X30ML15T15]
R46  2.2K  [RESC1608X55X30NL15T15]
R47  2.2K  [RESC1608X55X30NL15T15]
R48  10K  [RESC1609X55X30LL15T15]
R49  10K  [RESC1609X55X30LL15T15]
R50  10K  [RESC1609X55X30LL15T15]
R51  10K  [RESC1609X55X30LL15T15]
U13  CA-IS3722  [CA-IS3722HS]
U14  CA-IS3722  [CA-IS3722HS]
U15  PSM712-LF-T7  [PRKT-SOT23-3_V]
U16  MAX485CSA  [21-0041B_8]

### Ports
RS485_A (bidir, see Main[8B]), RS485_B (bidir, see Main[8B]), RS485_DIR (in, see Main[7B], STM32_MCU[7B]), RS485_RX (out, see Main[7B], STM32_MCU[7B]), RS485_TX (in, see Main[7B], STM32_MCU[7B])

### Nets
3V3: U13.1(VDDA) U14.1(VDDA)
5V_ISO: C26.2 C27.1 J1.2 R46.1 R47.1 U13.8(VDDB) U14.8(VDDB) U16.8(VCC)
5V_ISO_GND: C26.1 C27.2 J1.4 Q8.2(E) Q9.2(E) R50.1 R51.1 U13.5(GNDB) U13.7(VI1) U14.5(GNDB) U15.3 U16.5(GND)
GND: U13.4(GNDA) U14.4(GNDA)
A: R23.2 R25.1 U15.1 U16.6(A) ; port RS485_A
B: J1.6 R24.2 U15.2 U16.7(B) ; port RS485_B
DIR: U13.6(VO2) U16.2(*RE) U16.3(DE)
PA8: U13.3(VI2) ; port RS485_DIR
PA9: U14.3(VI2) ; port RS485_TX
PA10: U14.2(VO1) ; port RS485_RX
RX: R49.2 U14.6(VO2) U16.4(DI)
TX: R48.2 U14.7(VI1) U16.1(RO)
NetD20_1: D20.1(K) Q8.3(C)
NetD20_2: D20.2(A) R46.2
NetD21_1: D21.1(K) Q9.3(C)
NetD21_2: D21.2(A) R47.2
NetJ1_1: J1.1 R23.1
NetJ1_3: J1.3 R24.1
NetJ1_5: J1.5 R25.2
NetQ8_1: Q8.1(B) R48.1 R50.2
NetQ9_1: Q9.1(B) R49.1 R51.2

Not connected (* = marked no-connect by the designer): U13 2(VO1)

### Notes on the sheet
- RS485 DIR ISOLATION
- RS485 TX RX ISOLATION
- TVS
- MAX485 TRANSCEIVER
- TX LED
- RX LED
- (near R23) Biasing
- (near R25) Termination

### Library data of the parts
C26 = CMP-2000-07546-2: as C29 on sheet I2C_EEPROM_AT24C32; Weight: 7.1E-05oz; Composition: Ceramic; Max Operating Temperature: 125°C; Termination: SMD/SMT; Dielectric: X7R; Length: 1.6mm; Package Quantity: 1; REACH SVHC: No SVHC; Lead Free: Lead Free; Case Code (Metric): 1608; Min Operating Temperature: -55°C; Packaging: Tape and Reel; Tolerance: 10%; Voltage Rating: 50V; Case Code (Imperial): 0603; Capacitance: 100nF; Case/Package: 0603; Voltage Rating (DC): 50V; Depth: 0.8mm; Radiation Hardening: No; Ratings: AEC-Q200; Mount: Surface Mount; Voltage: 50V; Thickness: 0.035inch; Width: 0.8mm; Height: 0.8mm
C27 = CMP-2006-02792-2: Chip Multilayer Ceramic Capacitors for General Purpose, 0603, 10uF, X5R, 15%, 20%, 6.3V; Packaging: Tape and Reel; Voltage Rating (DC): 6.3V; Width: 0.031inch; Termination: SMD/SMT; Dielectric: X5R; Package Quantity: 4000; Voltage Rating: 6.3V; Capacitance: 10uF; Case/Package: 0603; Min Operating Temperature: -55°C; Voltage: 6.3V; Length: 1.6mm; Thickness: 0.035inch; Lead Free: Lead Free; Depth: 0.8mm; Case Code (Imperial): 0603; Max Operating Temperature: 85°C; Material: Ceramic; Height: 0.8mm; Tolerance: 20%; Mount: Surface Mount; REACH SVHC: No SVHC; Radiation Hardening: No; Case Code (Metric): 1608
D20 D21 = CMP-1426-00015-3: WL-SMCW SMT Mono-Color Chip LED Waterclear; Manufacturer Package Identifier: LED_1206; Dominant Wavelength: 470nm; Lens Style: Clear, Rectangular; Test Current: 20mA; Forward Voltage: 3.2V; Forward Current: 100mA; Peak Wavelength: 465nm; Max Reverse Voltage (DC): 5V; Viewing Angle: 140°; Luminous Intensity: 145mcd; Max Operating Temperature: 85°C; Case Code (Imperial): 1206; Length: 3.2mm; Width: 1.6mm; Min Operating Temperature: -40°C; Height: 680µm; Case Code (Metric): 3216; Packaging: Tape and Reel; RoHS: Compliant; Case/Package: 1206; REACH SVHC: Unknown; Wavelength: 470nm; Mount: Surface Mount; Color: Blue
Q8 Q9 = CMP-1693-00003-4: TRANS NPN 40V 0.6A SMD SOT23-3; Number of Elements: 1; Frequency: 300MHz; Max Collector Current: 600mA; Collector Base Voltage (VCBO): 75V; Current: 1A; Element Configuration: Single; Power Dissipation: 350mW; hFE Min: 100; Collector Emitter Saturation Voltage: 1V; Max Power Dissipation: 300mW; Emitter Base Voltage (VEBO): 6V; Voltage: 40V; Collector Emitter Breakdown Voltage: 40V; Width: 1.4mm; Polarity: NPN; Termination: SMD/SMT; Max Operating Temperature: 150°C; Transition Frequency: 300MHz; Contact Plating: Tin; Mount: Surface Mount; Max Frequency: 300MHz; Case/Package: SOT-23; Gain Bandwidth Product: 300MHz; Lead Free: Lead Free; Collector Emitter Voltage (VCEO): 40V; Radiation Hardening: No; Voltage Rating (DC): 40V; Height: 1mm; Max Breakdown Voltage: 40V; Packaging: Tape and Reel; Length: 3.05mm; Min Operating Temperature: -55°C; Weight: 0.000282oz; Current Rating: 600mA; REACH SVHC: No SVHC; Package Quantity: 3000; Continuous Collector Current: 600mA; Number of Pins: 3
R23 R24 R48-R51 = CMP-1012-00623-3: Chip Resistor, 10 KOhm, +/- 1%, 0.1 W, -55 to 155 degC, 0603 (1608 Metric), RoHS, Tape and Reel; Manufacturer: Panasonic; Voltage Rating: 75V; Case\/Package: 0603; Power Rating: 100mW; Resistance: 10KOhm; Temperature Coefficient: 100ppm\/degreesC; Number of Pins: 2; Package Reference: 603; Depth: 0.8mm; Mount: SurfaceMount; Package Description: 2-Pin Surface Mount Device, Body 1.6 x 0.85 mm; Datasheet Version: 02/2017; Length: 1.6mm; Lead Free: LeadFree; Height: 0.45mm; Number of Terminations: 2; Max Power Dissipation: 100mW; Min Operating Temperature: -55degC; Datasheet URL: https://industrial.panasonic.com/cdbs/www-data/pdf/RDA0000/AOA0000C304.pdf; Termination: SMD/SMT; Case Code (Metric): 1608; Case Code (Imperial): 0603; Tolerance: 1%; Max Operating Temperature: 155degC; RoHSCompliant: true; Voltage Rating (DC): 75V; Radiation Hardening: No; Packaging: TapeandReel; Composition: ThickFilm; Mounting Technology: SurfaceMount; Manufacturer URL: http://www.panasonic.com/; Width: 0.031inch; REACH SVHC: NoSVHC; Contact Plating: Tin; Military Standard: Not; Package Quantity: 1
R25 = CMP-2000-00213-2: Chip Resistor, 120 Ohm, +/- 1%, 0.1 W, -55 to 155 degC, 0603 (1608 Metric), RoHS, Tape and Reel; Manufacturer: Panasonic; Power Rating: 100mW; Voltage Rating (DC): 75V; Resistance: 120Ohm; Temperature Coefficient: 100ppm/degreesC; Number of Terminations: 2; Military Standard: Not; Tolerance: 1%; Min Operating Temperature: -55degC; Packaging: TapeandReel; Lead Free: LeadFree; Max Operating Temperature: 155degC; Manufacturer URL: http://www.panasonic.com/; Case Code (Imperial): 0603; REACH SVHC: NoSVHC; Width: 0.031inch; Datasheet URL: https://industrial.panasonic.com/cdbs/www-data/pdf/RDA0000/AOA0000C283.pdf; RoHSCompliant: true; Max Power Dissipation: 100mW; Termination: SMD/SMT; Package Reference: 0603; Height: 0.022inch; Depth: 0.8mm; Package Description: 2-Pin Surface Mount Device, Body 1.6 x 0.85 mm; Contact Plating: Tin; Length: 1.6mm; Package URL: http://www.st.com/st-web-ui/static/active/en/resource/technical/document/datasheet/CD00001320.pdf; Radiation Hardening: No; Package Quantity: 1; Number of Pins: 2; Datasheet Version: 42095.0; Voltage Rating: 75V; Composition: ThickFilm; Case/Package: 0603; Mount: SurfaceMount; Case Code (Metric): 1608
R46 R47 = CMP-1012-00586-3: Precision Thick Film Chip Resistor, 4.7 KOhm, +/- 1%, -55 to 155 degC, 0603 (1608 Metric), RoHS, Tape and Reel; Resistance: 220 Ohm; Voltage Rating: 50 V; Elements: 4; Case\Package: 1205; Tolerance: 5%; Power Rating: 250 mW; PackageReference: 0603; Max Operating Temperature: 125 degC; REACH SVHC: No SVHC; Width: 0.063 inch; Length: 0.126 inch; Height: 0.024 inch; Mount: Surface Mount; Package Quantity: 1; DatasheetVersion: Apr-15; ComponentLink1Description: Manufacturer URL; Min Operating Temperature: -55 degC; Packaging: Tape and Reel; Radiation Hardening: No; ComponentLink2URL: http://industrial.panasonic.com/cdbs/www-data/pdf/RDA0000/AOA0000C86.pdf; Case Code (Metric): 3216; Pins: 8; Case Code (Imperial): 1206; Type (Resistor): Thick Film; RoHSCompliant: true; ComponentLink2Description: Datasheet; PackageDescription: 2-Pin Surface Mount Device, Body 1.6 x 0.85 mm; ComponentLink1URL: http://www.panasonic.com/
U13 U14 = CA-IS3722: Dual Channel Standard Digital Isolators
U15 = CMP-2000-07553-1: TVS Array - Asymmetrical Data Line Protector, 600 W, 7.5 V, -55 to 150 degC, 3-Pin SOT23, RoHS, Tape and Reel; Manufacturer: Protek Devices; Min Breakdown Voltage: 7.5V; Direction: Bidirectional; Capacitance: 75pF; Current: 20uA; Power Dissipation: 600W; Working Voltage: 7V; Voltage: 12V; Case\/Package: SOT-23; Clamping Voltage: 17V; Element Configuration: Dual; Mounting Technology: SurfaceMount; RoHSCompliant: True; Radiation Hardening: No; Depth: 1.4mm; Lead Free: LeadFree; Package Description: 3-Pin Small Outline Transistor, Body 2.92 x 1.3 mm, Pitch 0.94 mm; Max Operating Temperature: 150degC; Length: 3.04mm; Manufacturer URL: http://www.protekdevices.com/; Min Operating Temperature: -55degC; Leakage Current: 20uA; Datasheet URL: www.protekdevices.com/xyz/documents/datasheets/psm712.pdf; Packaging: TapeandReel; Datasheet Version: 10/2013; Package Reference: SOT23-3; Number of Pins: 3
U16 = MAX485CSA: Low-Power, Slew-Rate-Limited RS-485/RS-422 Transceivers; MF: Analog Devices; MP: MAX485CSA+; SnapEDA_Link: https://www.snapeda.com/parts/MAX485CSA+/Analog+Devices/view-part/?ref=snap; Package: SOIC-8 Maxim; Value: *; Check_prices: https://www.snapeda.com/parts/MAX485CSA+/Analog+Devices/view-part/?ref=eda

## Sheet I2C_Isolator.SchDoc: Embedded Controller
size A4; DocumentNumber: 2; SheetNumber: 2; SheetTotal: 16
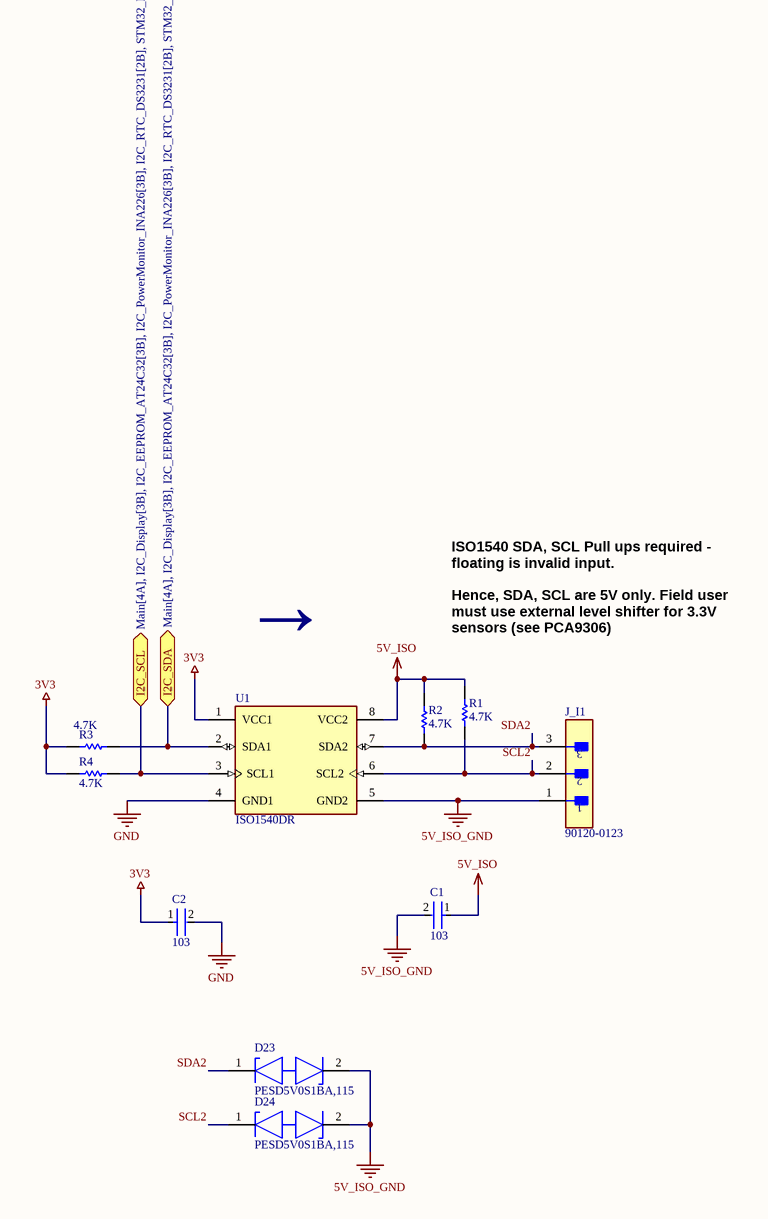
[diagram p6: I2C_Isolator.SchDoc]

### Parts
C1  103  [FP-CC0603-DA-MFG]
C2  103  [FP-CC0603-DA-MFG]
D23  PESD5V0S1BA,115  [FP-SOD323-CA-MFG]
D24  PESD5V0S1BA,115  [FP-SOD323-CA-MFG]
J_I1  90120-0123  [FP-90120-0123-MFG]
R1  4.7K  [RESC1608X55X25ML10T15]
R2  4.7K  [RESC1608X55X25ML10T15]
R3  4.7K  [RESC1608X55X25ML10T15]
R4  4.7K  [RESC1608X55X25ML10T15]
U1  ISO1540DR  [FP-D0008A-MFG]

### Ports
I2C_SCL (bidir, see Main[4A], I2C_Display[3B], I2C_EEPROM_AT24C32[3B], I2C_PowerMonitor_INA226[3B], I2C_RTC_DS3231[2B], STM32_MCU[8B]), I2C_SDA (bidir, see Main[4A], I2C_Display[3B], I2C_EEPROM_AT24C32[3B], I2C_PowerMonitor_INA226[3B], I2C_RTC_DS3231[2B], STM32_MCU[8B])

### Nets
3V3: C2.1 R3.2 R4.2 U1.1(VCC1)
5V_ISO: C1.1 R1.2 R2.2 U1.8(VCC2)
5V_ISO_GND: C1.2 D23.2(K2) D24.2(K2) J_I1.1 U1.5(GND2)
GND: C2.2 U1.4(GND1)
I2C_SCL: R4.1 U1.3(SCL1) ; port I2C_SCL
I2C_SDA: R3.1 U1.2(SDA1) ; port I2C_SDA
SCL2: D24.1(K1) J_I1.2 R1.1 U1.6(SCL2)
SDA2: D23.1(K1) J_I1.3 R2.1 U1.7(SDA2)

### Notes on the sheet
- →
- ISO1540 SDA, SCL Pull ups required - floating is invalid input.
  Hence, SDA, SCL are 5V only. Field user must use external level shifter for 3.3V sensors (see PCA9306)

### Library data of the parts
C1 C2 = CMP-2000-05002-2: CAP CER 0.1UF 16V X7R 0603; Manufacturer Part Number: CC0603KRX7R7BB104; Manufacturer: YAGEO; Tolerance: 0.1; Value: 100 nF; Temperature Coefficient: 15%; Material: Ceramic; Voltage Rating: 16 V; Package: CC0603-DA; ComponentLink2Description: Datasheet; Octopart: https://octopart.com/cc0603krx7r7bb104-yageo-192941; Temperature Range High: +125°C; Digikey Description: CAP CER 0.1UF 16V X7R 0603; Voltage: 16 V; Device Class L2: Capacitors; Height: 0.9mm; Temperature: -55°C to +125°C; Device Class L1: Passive Components; Device Class L3: Ceramic Capacitors; ComponentLink2URL: http://www.yageo.com/documents/recent/UPY-GPHC_X7R_6.3V-to-50V_18.pdf; Footprint Url: http://www.yageo.com/exep/pages/download/literatures/UPY-C_GEN_24.pdf; RoHS: TRUE; Temperature Range Low: -55°C; Temperature Characteristic: X7R; Lead Free: Yes; Capacitance: 100 nF; Category: Cap; Mouser Description: Multilayer Ceramic Capacitor, CC Series, 0.1 - F, - 10%, X7R, 16 V, 0603 [1608 Metric]; Automotive: No
D23 D24 = CMP-14432-000001-1: TVS DIODE 5V 14V SOD323
J_I1 = CMP-04776-000237-1: CONN HEADER VERT 3POS 2.54MM; Number of Circuits: 3; Max Voltage Rating (DC): 350.35kV; Contact Resistance: 20mR; Gender: Male; Voltage Rating (AC): 350V; Glow Wire Compliant: Non-compliant; Current Rating: 3A; Contact Post Length: 2.9mm; Number of Contacts: 3; Number of Rows: 1; Max Operating Temperature: 125°C; Orientation: Vertical; Number of Positions: 3; Packaging: Tray; Contact Mating Length: 6.75mm; Housing Color: Black; Termination: Solder; Contact Material: Brass; Radiation Hardening: No; Lead Free: Lead Free; Pitch: 2.54mm; RoHS Compliant: Yes; Voltage Rating: 350V; Contact Plating: Tin; Color: Black; Min Operating Temperature: -55°C; Mount: Through Hole; Housing Material: Polyester; Series: 90120; Contact Gender: Male; REACH SVHC: No SVHC
R1-R4 = CMP-2000-05024-1: Chip Resistor, 4.7 KOhm, +/- 5%, 100 mW, -55 to 155 degC, 0603 (1608 Metric), RoHS, Tape and Reel; Manufacturer: Yageo; Resistance: 4.7kOhms; Temperature Coefficient: 100PPM/C; Power Rating: 100mW; Voltage Rating: 50V; Operating Temperature Range: -55Cto+155C; Case Code - mm: 1608; Tolerance: 5%; Product: ThickFilmResistorsGeneralPurpose; Case Code - in: 0603; Datasheet URL: http://www.yageo.com/documents/recent/PYu-RC_Group_51_RoHS_L_04.pdf; Package Reference: 603; Datasheet Version: Rev. 4, 02/2016; Package Description: 2-Pin Surface Mount Device, Body 1.6 x 0.8 mm; Manufacturer URL: http://www.yageo.com/; Series: RC; Packaging: Reel; Termination Style: SMD/SMT
U1 = CMP-04872-000011-1: DGTL ISO 2.5KV 2CH I2C 8SOIC; Manufacturer: Texas Instruments; Max Supply Voltage: 5.5V; Interface: I2C,SMBus,Other; Nominal Supply Current: 1.7-3.1mA; Standoff Height: 0.11mm; Max Junction Temp: +136°C; Min Supply Voltage: 3V; Ipc Land Pattern Name: SOIC127P600X175-8; Ambient Temperature Range Low: -40°C; Temperature: -40°C to +125°C; Device Class L3: unset; Mouser Description: Digital Isolators Low-Power,Bidirec I2C Iso; Manufacturer Part Number: ISO1540DR; Octopart: https://octopart.com/iso1540dr-texas+instruments-24334113; Digikey Description: DGTL ISO 2.5KV 2CH I2C 8SOIC; Category: IC; Height: 1.75mm; Ambient Temperature Range High: +125°C; RoHS: TRUE; Automotive: No; Package: D0008A; ComponentLink2URL: http://www.ti.com/lit/ds/symlink/iso1540.pdf; Device Class L2: Interface ICs; Device Class L1: Integrated Circuits (ICs); Temperature Range Low: -40°C; Lead Free: Yes; ComponentLink2Description: Datasheet; Temperature Range High: +125°C

## Sheet AIn_Isolator.SchDoc: Embedded Controller
size A4; DocumentNumber: 6; SheetNumber: 6; SheetTotal: 16
Used 4 times, as channels U_AIN1, U_AIN2, U_AIN3, U_AIN4. Parts and nets are listed once, with the designators drawn on the sheet.
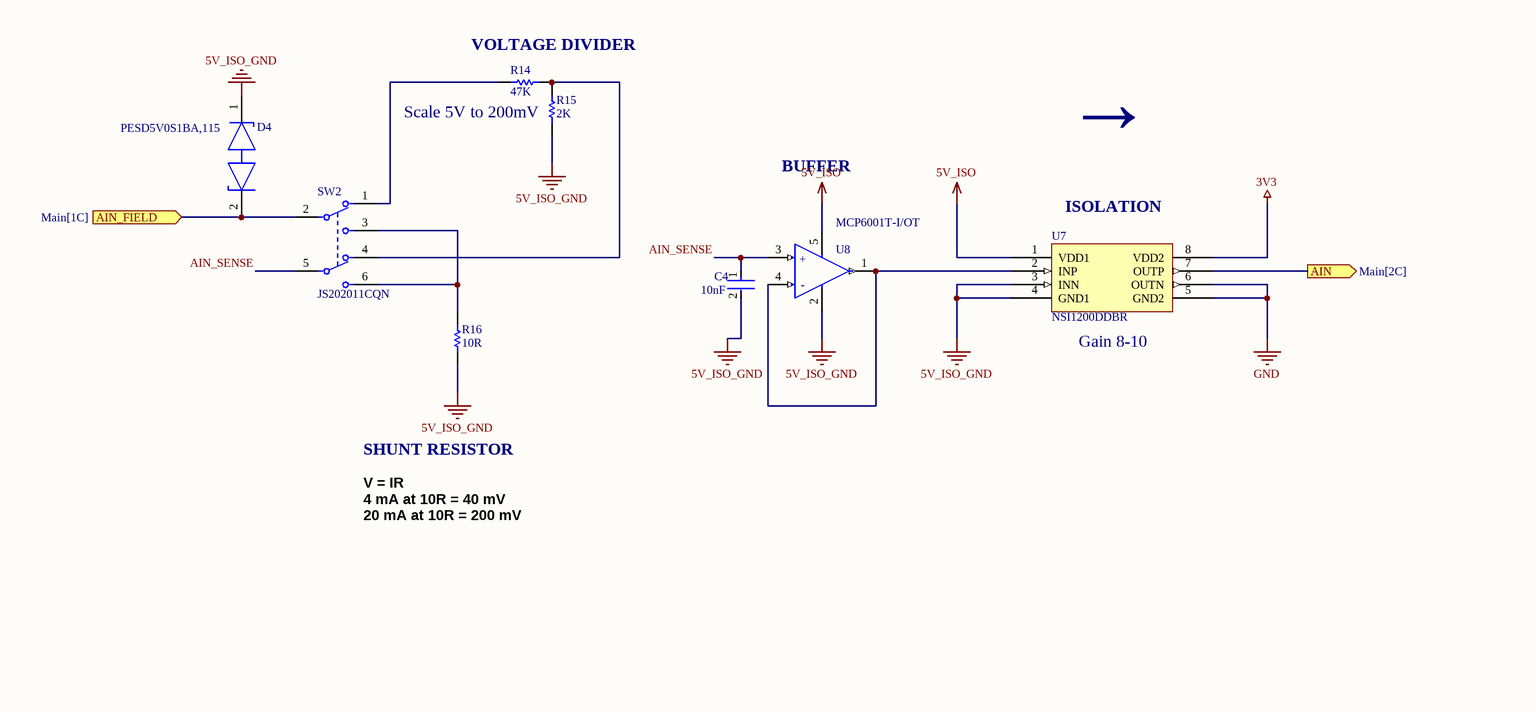
[diagram p7: AIn_Isolator.SchDoc, left]
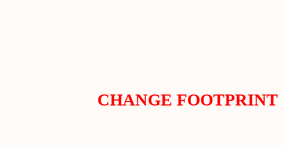
[diagram p8: AIn_Isolator.SchDoc, right]

### Parts
C4  10nF  [FP-CC0603-DA-MFG]
D4  PESD5V0S1BA,115  [FP-SOD323-CA-MFG]
R14  47K  [RESC1608X55X30NL15T15]
R15  2K  [RESC1608X55X30ML15T15]
R16  10R  [RESC3216X70X50LL20T25]
SW2  JS202011CQN  [FP-JS202011CQN-MFG - duplicate]
U7  NSI1200DDBR  [NSI1200DDBR]
U8  MCP6001T-I/OT  [FP-C04-091-OT-IPC_A]

### Ports
AIN (out, see Main[2C]), AIN_FIELD (in, see Main[1C])

### Nets
3V3: U7.8(VDD2)
5V_ISO: U7.1(VDD1) U8.5(VDD)
5V_ISO_GND: C4.2 D4.1(K1) R15.1 R16.2 U7.3(INN) U7.4(GND1) U8.2(VSS)
GND: U7.5(GND2) U7.6(OUTN)
AIN: U7.7(OUTP) ; port AIN
AIN_FIELD: D4.2(K2) SW2.2 ; port AIN_FIELD
AIN_SENSE: C4.1 SW2.5 U8.3(VIN+)
NetR14_1: R14.1 SW2.1
NetR14_2: R14.2 R15.2 SW2.4
NetR16_1: R16.1 SW2.3 SW2.6
NetU7_2: U7.2(INP) U8.1(VOUT) U8.4(VIN-)

### Channels
U_AIN1: designators end in A; ports AIN=AIN1 AIN_FIELD=AIN1_FIELD
U_AIN2: designators end in B; ports AIN=AIN2 AIN_FIELD=AIN2_FIELD
U_AIN3: designators end in C; ports AIN=AIN3 AIN_FIELD=AIN3_FIELD
U_AIN4: designators end in D; ports AIN=AIN4 AIN_FIELD=AIN4_FIELD

### Notes on the sheet
- VOLTAGE DIVIDER
- (near R15) Scale 5V to 200mV
- →
- BUFFER
- (near U7) ISOLATION
- (near U7) Gain 8-10
- SHUNT RESISTOR
- V = IR
  4 mA at 10R = 40 mV
  20 mA at 10R = 200 mV
- CHANGE FOOTPRINT
- (in symbol CMP-0187-00462-3) +; -

### Library data of the parts
C4 = CMP-2100-03600-2: CAP CER 10000PF 50V X7R 0603; Manufacturer Part Number: CC0603KRX7R9BB103; Manufacturer: YAGEO; Tolerance: 0.1; Material: Ceramic; Temperature Coefficient: 15%; Mouser Description: Multilayer Ceramic Capacitor, CC Series, 0.01 - F, - 10%, X7R, 50 V, 0603 [1608 Metric]; Digikey Description: CAP CER 10000PF 50V X7R 0603; Height: 0.9mm; Category: Cap; Temperature Characteristic: X7R; Footprint Url: http://www.yageo.com/exep/pages/download/literatures/UPY-C_GEN_24.pdf; Lead Free: Yes; Voltage Rating: 50 V; Temperature: -55°C to +125°C; Device Class L3: Ceramic Capacitors; ComponentLink2Description: Datasheet; Voltage: 50 V; Package: CC0603-DA; Octopart: https://octopart.com/cc0603krx7r9bb103-yageo-192938; Automotive: No; Temperature Range High: +125°C; Temperature Range Low: -55°C; Value: 10 nF; RoHS: TRUE; Device Class L1: Passive Components; ComponentLink2URL: http://www.yageo.com/documents/recent/UPY-GPHC_X7R_6.3V-to-50V_18.pdf; Device Class L2: Capacitors; Capacitance: 10 nF
D4 = CMP-14432-000001-1: TVS DIODE 5V 14V SOD323
R14 = CMP-2000-00523-2: Chip Resistor, 47 KOhm, +/- 1%, 0.1 W, -55 to 155 degC, 0603 (1608 Metric), RoHS, Tape and Reel; Case\Package: 0603; Forward Current: 20 mA; Power Rating: 90 mW; Illumination Colour: Red; Nominal Vf: 2.1 V; Viewing Angle: 160 degrees; Luminous Intensity: 63 mcd; Lens Style: Clear; Nominal Wavelength: 639 nm; Case Code (Imperial): 0603; Case Code (Metric): 1608; Packaging: Tape and Reel; Radiation Hardening: No; Colour: Red; PackageDescription: 2-Pin Surface Mount Device, Body 1.6 x 0.85 mm; ComponentLink1Description: Manufacturer URL; Width: 0.8 mm; DatasheetVersion: Apr-15; ComponentLink2URL: http://industrial.panasonic.com/cdbs/www-data/pdf/RDA0000/AOA0000C86.pdf; Min Operating Temperature: -40 degC; Height: 0.6 mm; Package Quantity: 3000; ComponentLink2Description: Datasheet; REACH SVHC: No SVHC; ComponentLink1URL: http://www.panasonic.com/; Mount: Surface Mount; RoHSCompliant: true; Max Operating Temperature: 100 degC; PackageReference: 0603; Length: 1.6 mm; Forward Voltage: 2.1 V; Pins: 2
R15 = CMP-2000-00317-1: Part Number: ERJ-3EKF2001V; Manufacturer: Panasonic
R16 = CMP-2003-04407-1: as R42 on sheet Power_Supply
SW2 = CMP-10038-000022-1_1: SWITCH SLIDE DPDT 300MA 6V; Contact Resistance: 70mR; Actuator Type: Standard; Actuator Color: Black; Actuator Material: Nylon; Actuator Length: 2mm; Contact Current Rating: 100mA; Electrical Life: 5000Cycles; Illumination Type: Non-Illuminated; Switch Function: On-On; Depth: 3.6mm; Lead Free: Lead Free; Current Rating: 300mA; Throw Configuration: DPDT; REACH SVHC: No SVHC; Flammability Rating: UL94 V-0; Contact Plating: Silver; Max Current Rating: 300mA; Packaging: Bulk; Radiation Hardening: No; Switch Travel: 2mm; Package Quantity: 1; Voltage Rating (DC): 6V; Housing Material: Nylon; Contact Material: Copper Alloy; Min Operating Temperature: -40°C; Max Operating Temperature: 85°C; Termination: PC Pins; Mount: Through Hole; Length: 9mm; Max Voltage Rating (DC): 6V; RoHS Compliant: Yes; Series: JS; Orientation: Vertical
U7 = NSI1200DDBR: High Reliability Reinforced Isolated Amplifier; Manufacturer: Novosense; Manufacturer Part Number: NSI1200DDBR; ComponentLink1Description: Datasheet; ComponentLink1URL: https://file.elecfans.com/web2/M00/63/D8/poYBAGMEo2GAVfdLABzacvfTaPY750.pdf
U8 = CMP-0187-00462-3: IC OPAMP GP 1 CIRCUIT SOT23-5; Number of Amplifiers: 1; Voltage: 6V; Power Supply Rejection Ratio (PSRR): 86dB; Common Mode Rejection Ratio: 60dB; Unity Gain Bandwidth Product: 1MHz; Slew Rate: 0.6V/µs; Output Current per Channel: 23mA; Nominal Supply Current: 100uA; Input Offset Voltage (Vos): 4.5mV; Input Bias Current: 1pA; Operating Supply Voltage: 5.5V; Min Supply Voltage: 1.8V; Voltage Gain: 112dB; Length: 3.1mm; REACH SVHC: No SVHC; Number of Pins: 5; Package Quantity: 1; Radiation Hardening: No; Mount: Surface Mount; Number of Circuits: 1; Number of Elements: 1; Output Current: 23mA; Packaging: Tape and Reel; Height: 1.3mm; Lead Free: Lead Free; Min Operating Temperature: -40°C; Bandwidth: 1MHz; Contact Plating: Tin; Max Supply Voltage: 6V; Max Operating Temperature: 85°C; Width: 1.8mm; Case/Package: SOT-23; Operating Supply Current: 100uA; Number of Channels: 1; Gain Bandwidth Product: 1MHz